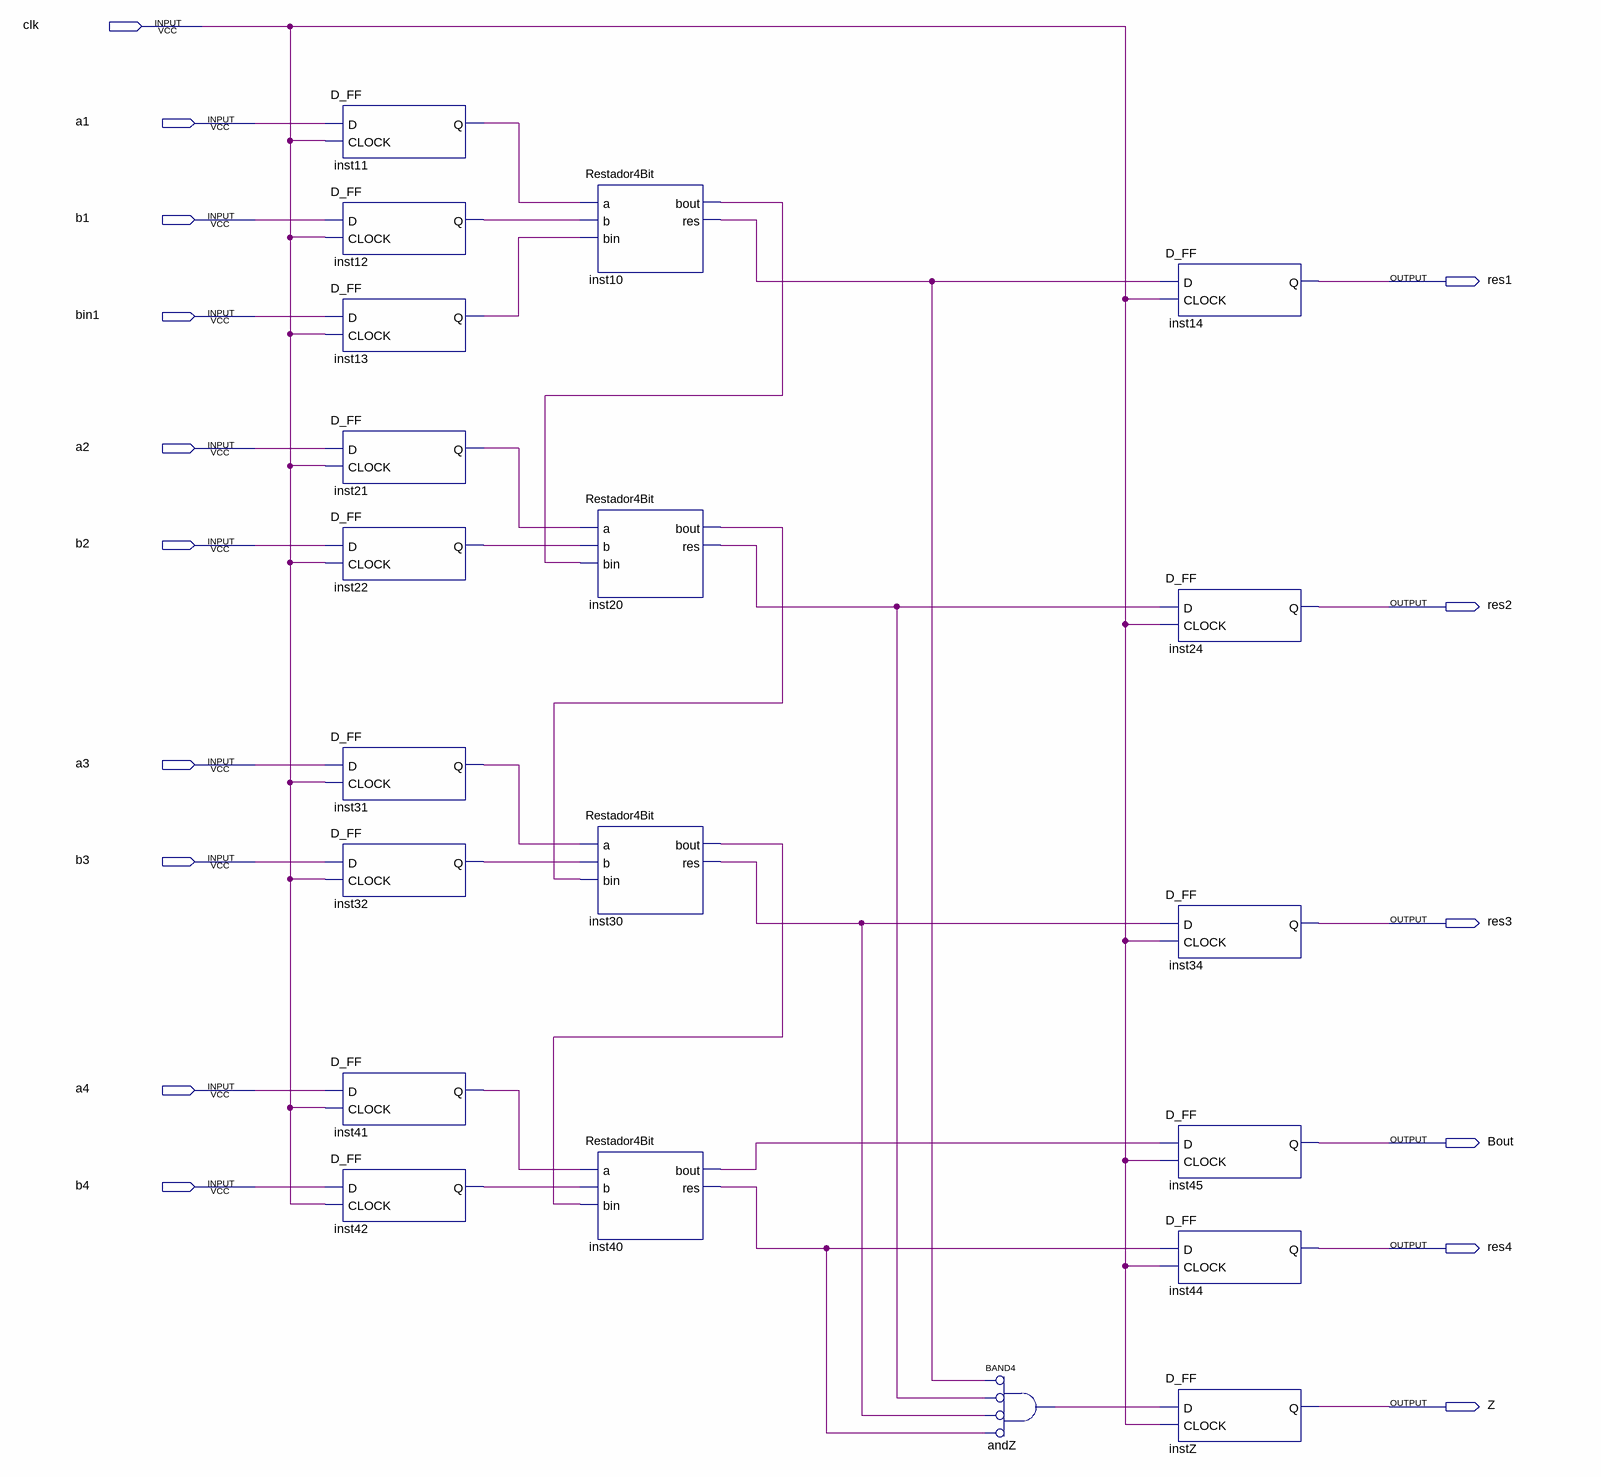
[diagram p0: schematic sheet]
// Quartus schematic Block2.bdf as structural Verilog: 20 symbols, 16 pins
module Block2 (
  input  clk,
  input  a1,
  input  b1,
  input  bin1,
  input  a2,
  input  b2,
  input  a3,
  input  b3,
  input  a4,
  input  b4,
  output res1,
  output res2,
  output res3,
  output Bout,
  output res4,
  output Z
);

  wire andZ_out, inst10_bout, inst10_res, inst11_q, inst12_q, inst13_q, inst20_bout, inst20_res, inst21_q,
       inst22_q, inst30_bout, inst30_res, inst31_q, inst32_q, inst40_bout, inst40_res, inst41_q, inst42_q;

  D_FF inst11 (.D(a1), .CLOCK(clk), .Q(inst11_q));
  D_FF inst12 (.D(b1), .CLOCK(clk), .Q(inst12_q));
  D_FF inst13 (.D(bin1), .CLOCK(clk), .Q(inst13_q));
  D_FF inst21 (.D(a2), .CLOCK(clk), .Q(inst21_q));
  D_FF inst22 (.D(b2), .CLOCK(clk), .Q(inst22_q));
  D_FF inst31 (.D(a3), .CLOCK(clk), .Q(inst31_q));
  D_FF inst32 (.D(b3), .CLOCK(clk), .Q(inst32_q));
  D_FF inst41 (.D(a4), .CLOCK(clk), .Q(inst41_q));
  D_FF inst42 (.D(b4), .CLOCK(clk), .Q(inst42_q));
  Restador4Bit inst10 (.a(inst11_q), .b(inst12_q), .bin(inst13_q), .bout(inst10_bout), .res(inst10_res));
  Restador4Bit inst20 (.a(inst21_q), .b(inst22_q), .bin(inst10_bout), .bout(inst20_bout), .res(inst20_res));
  Restador4Bit inst30 (.a(inst31_q), .b(inst32_q), .bin(inst20_bout), .bout(inst30_bout), .res(inst30_res));
  Restador4Bit inst40 (.a(inst41_q), .b(inst42_q), .bin(inst30_bout), .bout(inst40_bout), .res(inst40_res));
  and andZ (andZ_out, ~inst10_res, ~inst20_res, ~inst30_res, ~inst40_res);  // BAND4
  D_FF inst14 (.D(inst10_res), .CLOCK(clk), .Q(res1));
  D_FF inst24 (.D(inst20_res), .CLOCK(clk), .Q(res2));
  D_FF inst34 (.D(inst30_res), .CLOCK(clk), .Q(res3));
  D_FF inst45 (.D(inst40_bout), .CLOCK(clk), .Q(Bout));
  D_FF inst44 (.D(inst40_res), .CLOCK(clk), .Q(res4));
  D_FF instZ (.D(andZ_out), .CLOCK(clk), .Q(Z));
endmodule
